# Altium project IndAlarmSe0.PrjPCB
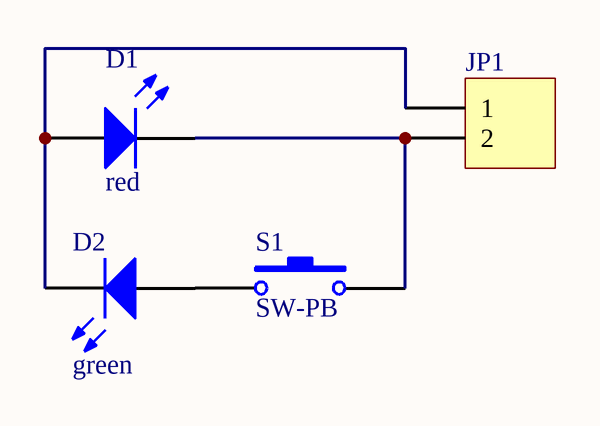
[diagram p0: IndAlarmSe0.SchDoc]
1 sheet, 4 parts. Net scope: global (net labels, ports and power ports of the same name join across sheets).
Board file: IndAlarmSe0.PcbDoc

## Sheet IndAlarmSe0.SchDoc
size A4

### Parts
D1  red  [led3mm]
D2  green  [LED3MM]
JP1  (no value)  [HDR1X2]
S1  SW-PB  [SPPB512300]

### Nets
NetD1_1: D1.1(A) D2.2(K) JP1.1
NetD1_2: D1.2(K) JP1.2 S1.2
NetD2_1: D2.1(A) S1.1

### Library data of the parts
D1 D2 = LED3: Typical BLUE SiC LED; Revision 1: Jul-2002: Re-released for DXP Platform.; Revision 2: 17-Dec-2003: PCB Footprint replaced.; Published: 8-Jun-2000; Publisher: Altium Limited
JP1 = Header 2: Header, 2-Pin; Revision: 17-Jul-2002: Re-released for DXP Platform.; Publisher: Altium Limited
S1 = SW-PB: Switch; Published: 24-Mar-1999; Revision: July-2002: Re-released for DXP Platform.; Publisher: Altium Limited